# Altium schematic sheet Spindle_Control.SchDoc: STM32F446 CNC
size B; Author: AM; CompanyName: Expatria Technologies; DrawnBy: A.Marles; Engineer: AM; Organization: Expatria Technolgoies; DocumentNumber: 5; SheetNumber: 5; SheetTotal: 14
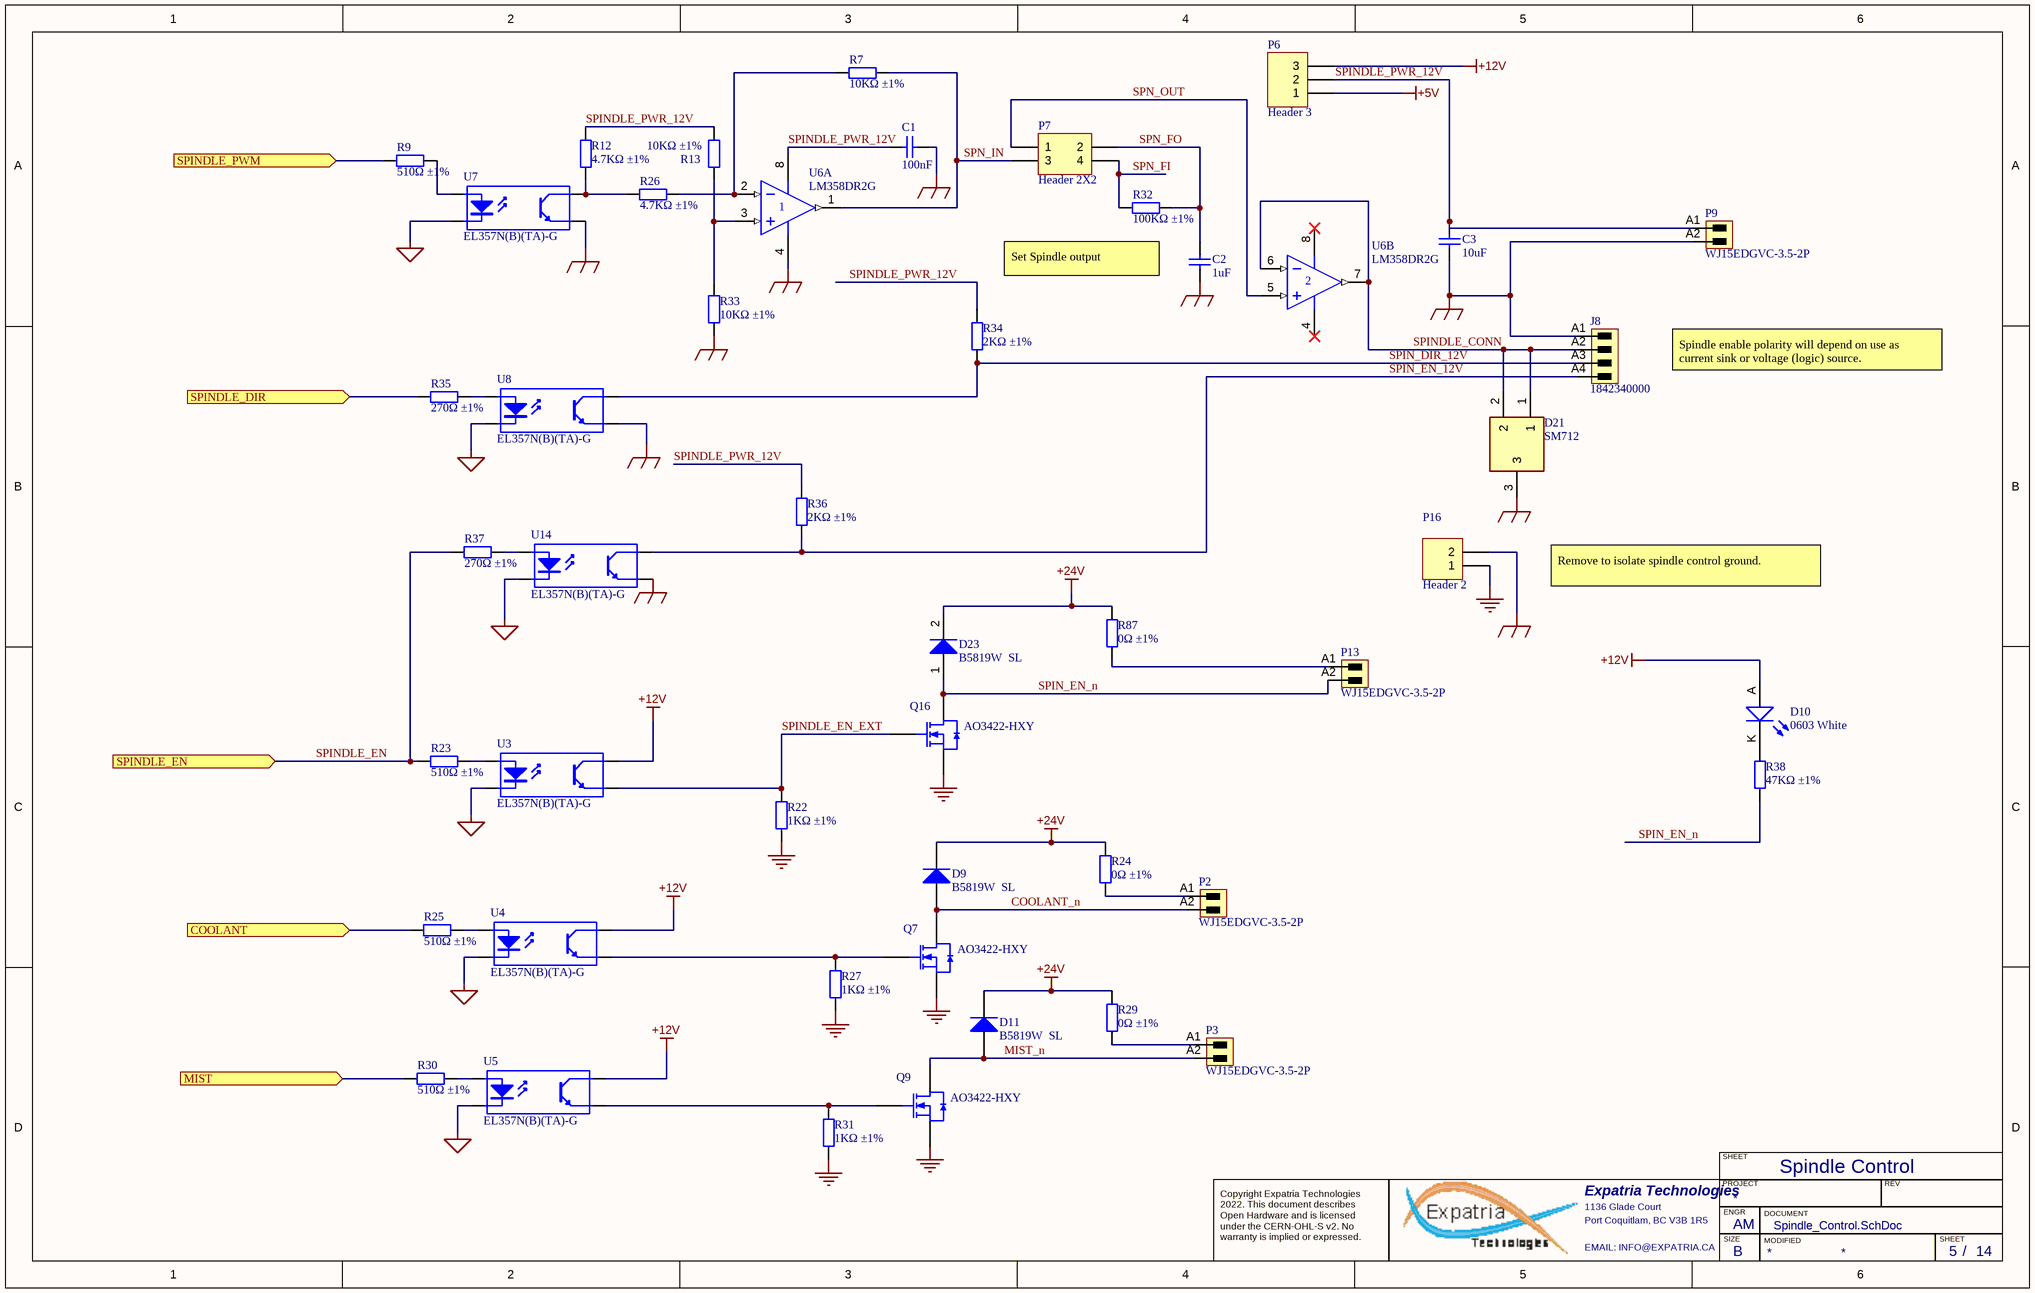
[diagram p0: Spindle_Control.SchDoc]

## Parts
C1  100nF  [0603_C]
C2  1uF  [0603_C]
C3  10uF  [1206_C]
D9  B5819W  SL  [SOD-123]
D10  0603 White  [0603_LED_S1]
D11  B5819W  SL  [SOD-123]
D21  SM712  [SOT95P230X117-3N]
D23  B5819W  SL  [SOD-123]
J8  1842340000  [691321100004]
P2  WJ15EDGVC-3.5-2P  [691321100002]
P3  WJ15EDGVC-3.5-2P  [691321100002]
P6  Header 3  [HDR1X3]
P7  Header 2X2  [HDR2X2]
P9  WJ15EDGVC-3.5-2P  [691321100002]
P13  WJ15EDGVC-3.5-2P  [691321100002]
P16  Header 2  [HDR1X2]
Q7  AO3422-HXY  [SOT-23-3L]
Q9  AO3422-HXY  [SOT-23-3L]
Q16  AO3422-HXY  [SOT-23-3L]
R7  10KΩ ±1%  [0603_R]
R9  510Ω ±1%  [0603_R]
R12  4.7KΩ ±1%  [0603_R]
R13  10KΩ ±1%  [0603_R]
R22  1KΩ ±1%  [0603_R]
R23  510Ω ±1%  [0603_R]
R24  0Ω ±1%  [0603_R]
R25  510Ω ±1%  [0603_R]
R26  4.7KΩ ±1%  [0603_R]
R27  1KΩ ±1%  [0603_R]
R29  0Ω ±1%  [0603_R]
R30  510Ω ±1%  [0603_R]
R31  1KΩ ±1%  [0603_R]
R32  100KΩ ±1%  [0603_R]
R33  10KΩ ±1%  [0603_R]
R34  2KΩ ±1%  [0603_R]
R35  270Ω ±1%  [0603_R]
R36  2KΩ ±1%  [0603_R]
R37  270Ω ±1%  [0603_R]
R38  47KΩ ±1%  [0603_R]
R87  0Ω ±1%  [0603_R]
U3  EL357N(B)(TA)-G  [SOP-4_P2.54]
U4  EL357N(B)(TA)-G  [SOP-4_P2.54]
U5  EL357N(B)(TA)-G  [SOP-4_P2.54]
U6  LM358DR2G  [SOIC-8_150mil]  (parts A,B of 2)
U7  EL357N(B)(TA)-G  [SOP-4_P2.54]
U8  EL357N(B)(TA)-G  [SOP-4_P2.54]
U14  EL357N(B)(TA)-G  [SOP-4_P2.54]

## Ports
COOLANT (in), MIST (in), SPINDLE_DIR (in), SPINDLE_EN (in), SPINDLE_PWM (in)

## Nets
+5V: P6.1
+12V: D10.A P6.3 U3.4(C) U4.4(C) U5.4(C)
+24V: D9.2(K) D11.2(K) D23.2(K) R24.1 R29.1 R87.1
GND: P16.1 Q7.2(S) Q9.2(S) Q16.2(S) R22.1 R27.1 R31.1
MCU_GND: U3.2(K) U4.2(K) U5.2(K) U7.2(K) U8.2(K) U14.2(K)
SPIN_GND: C1.1 C2.1 C3.1 D21.3 J8.A1 P9.A2 P16.2 R33.2 U6.4(V-) U7.3(E) U8.3(E) U14.3(E)
COOLANT: R25.1 ; port COOLANT
COOLANT_n: D9.1(A) P2.A2 Q7.3(D)
MIST: R30.1 ; port MIST
MIST_n: D11.1(A) P3.A2 Q9.3(D)
SPIN_DIR_12V: J8.A3 R34.1 U8.4(C)
SPIN_EN_12V: J8.A4 R36.1 U14.4(C)
SPIN_EN_n: D23.1(A) P13.A2 Q16.3(D) R38.1
SPINDLE_CONN: D21.1 D21.2 J8.A2 U6.6(IN-) U6.7(OUT)
SPINDLE_DIR: R35.1 ; port SPINDLE_DIR
SPINDLE_EN: R23.1 R37.1 ; port SPINDLE_EN
SPINDLE_EN_EXT: Q16.1(G) R22.2 U3.3(E)
SPINDLE_PWM: R9.1 ; port SPINDLE_PWM
SPINDLE_PWR_12V: C1.2 C3.2 P6.2 P9.A1 R12.1 R13.1 R34.2 R36.2 U6.8(V+)
SPN_FI: P7.4 R32.2
SPN_FO: C2.2 P7.2 R32.1
SPN_IN: P7.3 R7.2 U6.1(OUT)
SPN_OUT: P7.1 U6.5(IN+)
NetD10_K: D10.K R38.2
NetP2_A1: P2.A1 R24.2
NetP3_A1: P3.A1 R29.2
NetP13_A1: P13.A1 R87.2
NetQ7_1: Q7.1(G) R27.2 U4.3(E)
NetQ9_1: Q9.1(G) R31.2 U5.3(E)
NetR7_1: R7.1 R26.2 U6.2(IN-)
NetR9_2: R9.2 U7.1(A)
NetR12_2: R12.2 R26.1 U7.4(C)
NetR13_2: R13.2 R33.1 U6.3(IN+)
NetR23_2: R23.2 U3.1(A)
NetR25_2: R25.2 U4.1(A)
NetR30_2: R30.2 U5.1(A)
NetR35_2: R35.2 U8.1(A)
NetR37_2: R37.2 U14.1(A)

## Notes on the sheet
- Set Spindle output
- Spindle enable polarity will depend on use as current sink or voltage (logic) source.
- Remove to isolate spindle control ground.
- Spindle Control
- SHEET
- Expatria Technologies
- 1136 Glade Court
- Port Coquitlam, BC V3B 1R5
- PROJECT
- SIZE
- ENGR
- MODIFIED
- DOCUMENT
- REV
- Copyright Expatria Technologies 2022. This document describes Open Hardware and is licensed under the CERN-OHL-S v2. No warranty is implied or expressed.
- EMAIL: INFO@EXPATRIA.CA
- B
- /

## Library data of the parts
C1 = 0603 100nF (104) 10% 50V: Chip capacitors; Manufacturer: YAGEO; PartNumber: CC0603KRX7R9BB104; Tolerance: 10%; Voltage: 50V; Package: 0603; Supplier: LC; SuppliersPartNumber: C14663; Capacitance: 100nF; Manufacturer 1: YAGEO
C2 = 0603 1uF (105) 10% 50V: Chip capacitors; Manufacturer: Samsung Electro-Mechanics; PartNumber: CL10A105KB8NNNC; Tolerance: 10%; Voltage: 50V; Package: 0603; Supplier: LC; SuppliersPartNumber: C15849; Capacitance: 1uF; Manufacturer 1: Samsung Electro-Mechanics
C3 = 1206 10uF (106) 10% 50V: Chip capacitors; Manufacturer: Samsung Electro-Mechanics; PartNumber: CL31A106KBHNNNE; Tolerance: 10%; Voltage: 50V; Package: 1206; Supplier: LC; SuppliersPartNumber: C13585; Capacitance: 10uF; Manufacturer 1: Samsung Electro-Mechanics
D9 D11 D23 = SOD-123 B5819W  SL: Schottky Diode; ComponentLink1Description: 供应商链接; ComponentLink1URL: http://www.szlcsc.com/product/details_9093.html; Package: SOD-123; Supplier: LC; SuppliersPartNumber: C8598
D10 = 0603 LED White: LED; ComponentLink1Description: 供应商链接; ComponentLink1URL: http://www.szlcsc.com/product/details_2663.html; Package: 0603; Supplier: LC; SuppliersPartNumber: C2290; Color: White
D21 = CDSOT23-SM712: Bidirectional 12V (Max), 7V (Max) 7.5V / 13.3V 10V / 20V 12A(8/20us) SOT-23-3 TVS RoHS; Manufacturer_Name: DOWO; Height: 1.17mm; Manufacturer_Part_Number: SM712; SuppliersPartNumber: C293966; Manufacturer 1: DOWO; Manufacturer Part Number 1: SM712; Package: SOT-23-3
J8 = 3.5mm Terminal Header 4p: OMNIMATE Signal - series BL/SL 3.50; Revision: V1; SuppliersPartNumber: C880556; ComponentLink1URL: http://www.weidmueller.com/; ComponentLink1Description: Manufacturer URL; Supplier: LCSC
P2 P3 P9 P13 = 3.5mm Terminal Header 2p: Header,Male Pin,Covered(4 Sided) 2 1 0.138"（3.50mm） 2 P=3.5mm Pluggable System Terminal Block RoHS; Manufacturer: Ningbo Kangnex Elec; UL_94_flammability_rating: V-0; Pitch_mm: 3.5 mm; Side_termination_characteristic: closed side; Pitch_inch: 0.138 inch; Solder_pin_length_mm: 3.2 mm; Short_text_for_material: SL 3.50/02/180G 3.2SN OR BX; ComponentLink1Description: Manufacturer URL; ComponentLink1URL: http://www.weidmueller.com/; PartNumber: WJ15EDGVC-3.5-2P; Revision: V1; PackageReference: SL_3_50_180G_02; Packaging: Box; SuppliersPartNumber: C192777; Manufacturer 1: Ningbo Kangnex Elec; Manufacturer Part Number 1: WJ15EDGVC-3.5-2P
P6 = Header 3: Header, 3-Pin; Publisher: Altium Limited; SuppliersPartNumber: C49257
P7 = Header 2X2: Header, 2-Pin, Dual row; Supplier: LC; SuppliersPartNumber: C66690
P16 = Header 2: Header, 2-Pin; Publisher: Altium Limited; LatestRevisionDate: 17-Jul-2002; LatestRevisionNote: Re-released for DXP Platform.; SuppliersPartNumber: C234182
Q7 Q9 Q16 = AO3400A N道沟 X0YV1T SOT-23: 60V 4.5A 8W 75mΩ@10V,5A 2.5V@250uA N Channel 695pF@15V SOT-23-3L MOSFETs ROHS; ComponentLink1Description: 供应商链接; ComponentLink1URL: http://www.szlcsc.com/product/details_21629.html; Package: SOT-23L; Supplier: LC; SuppliersPartNumber: C4748727
R7 R13 R33 = 0603 10K (1002) 1%: Chip resistor; Manufacturer: Uniroyal Elec; PartNumber: 0603WAF1002T5E; Power: 1/10W; Package: 0603; Supplier: LC; SuppliersPartNumber: C25804; Resistance: 10KΩ; Tolerance: 1%; ComponentLink1Description: Supplier link; ComponentLink1URL: http://www.szlcsc.com/product/details_26547.html
R9 R23 R25 R30 = 0603 510R (5100) 1%: Chip resistor; Manufacturer: Uniroyal Elec; PartNumber: 0603WAF5100T5E; Power: 1/10W; Package: 0603; Supplier: LC; SuppliersPartNumber: C23193; Resistance: 510Ω; Tolerance: 1%; ComponentLink1Description: Supplier link; ComponentLink1URL: http://www.szlcsc.com/product/details_23920.html
R12 R26 = 0603 4.7K (4701) 1%: Chip resistor; Manufacturer: Uniroyal Elec; PartNumber: 0603WAF4701T5E; Power: 1/10W; Package: 0603; Supplier: LC; SuppliersPartNumber: C23162; Resistance: 4.7KΩ; Tolerance: 1%; ComponentLink1Description: Supplier link; ComponentLink1URL: http://www.szlcsc.com/product/details_23889.html
R22 R27 R31 = 0603 1K (1001) 1%: Chip resistor; Manufacturer: Uniroyal Elec; PartNumber: 0603WAF1001T5E; Power: 1/10W; ComponentLink1Description: Supplier link; ComponentLink1URL: http://www.szlcsc.com/product/details_21904.html; Package: 0603; Supplier: LC; SuppliersPartNumber: C21190; Resistance: 1KΩ; Tolerance: 1%
R24 R29 R87 = 0603 0R (0R0) 1%: Chip resistor; Manufacturer: Uniroyal Elec; PartNumber: 0603WAF0000T5E; Power: 1/10W; ComponentLink1Description: Supplier link; ComponentLink1URL: http://www.szlcsc.com/product/details_21903.html; Package: 0603; Supplier: LC; SuppliersPartNumber: C21189; Resistance: 0Ω; Tolerance: 1%
R32 = 0603 100K (1003) 1%: Chip resistor; Manufacturer: Uniroyal Elec; PartNumber: 0603WAF1003T5E; Power: 1/10W; Package: 0603; Supplier: LC; SuppliersPartNumber: C25803; Resistance: 100KΩ; Tolerance: 1%; ComponentLink1Description: Supplier link; ComponentLink1URL: http://www.szlcsc.com/product/details_26546.html
R34 R36 = 0603 2K (2001) 1%: Chip resistor; Manufacturer: Uniroyal Elec; PartNumber: 0603WAF2001T5E; Power: 1/10W; Package: 0603; Supplier: LC; SuppliersPartNumber: C22975; Resistance: 2KΩ; Tolerance: 1%; ComponentLink1Description: Supplier link; ComponentLink1URL: http://www.szlcsc.com/product/details_23702.html
R35 R37 = 0603 270R (2700) 1%: Chip resistor; Manufacturer: Uniroyal Elec; PartNumber: 0603WAF2700T5E; Power: 1/10W; Package: 0603; Supplier: LC; SuppliersPartNumber: C22966; Resistance: 270Ω; Tolerance: 1%; ComponentLink1Description: Supplier link; ComponentLink1URL: http://www.szlcsc.com/product/details_23693.html
R38 = 0603 47K (4702) 1%: Chip resistor; Manufacturer: Uniroyal Elec; PartNumber: 0603WAF4702T5E; Power: 1/10W; ComponentLink1Description: Supplier link; ComponentLink1URL: http://www.szlcsc.com/product/details_26562.html; Package: 0603; Supplier: LC; SuppliersPartNumber: C25819; Resistance: 47KΩ; Tolerance: 1%
U3-U5 U7 U8 U14 = EL357N(B)(TA)-G_[C6649]: OPTOISOLATOR 3.75KV TRANS 4-SOP; Manufacturer 1: Everlight Elec; Package: SOP-4_P2.54; Supplier: LC; SuppliersPartNumber: C6649; Manufacturer Part Number 1: EL357N(B)(TA)-G
  U3-U5: ComponentLink1Description: 供应商链接; ComponentLink1URL: http://www.szlcsc.com/product/details_7114.html
U6 = LM358DR2G_[C7950]: Dual Op Amp,  5 - 28 V,  8-PinSOIC; Manufacturer 1: ON Semiconductor; Package: SOIC-8; Supplier: LC; SuppliersPartNumber: C7950; Manufacturer Part Number 1: LM358DR2G; Packaging: Tape and Reel; Length: 5mm